# EAGLE design ESPIOX32 V0.2 (EAGLE 7.6.0)
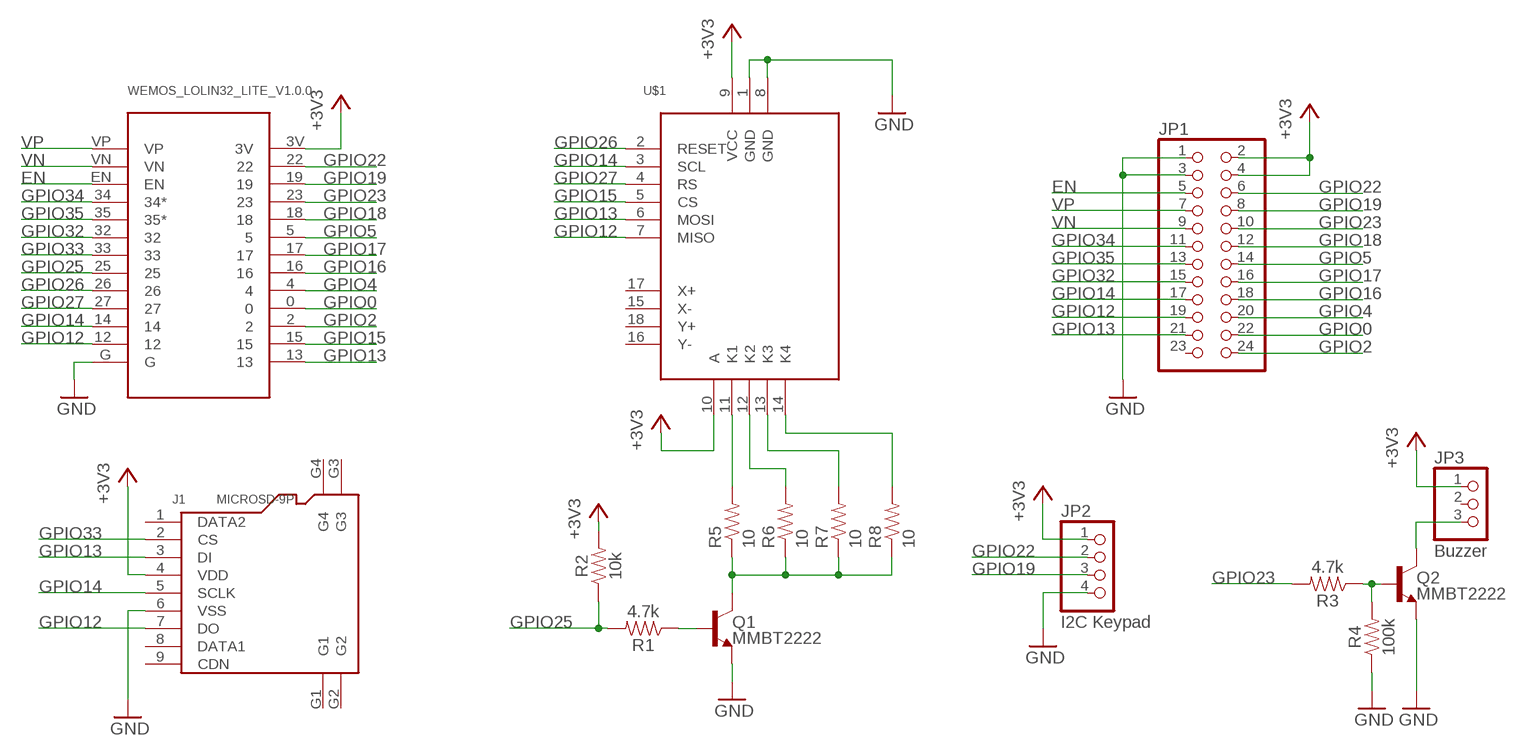
[diagram p0: schematic, sheet 1]

## Parts
J1  MICROSD-9P  MICRO-SD-CARD-HOLDER-9P  [MICRO-SD9+4P-SMD-16.1X14.5X1.85MM]
JP1  PINHD-2X12_2.54-SMD  [2X12SMD]
JP2  I2C Keypad  PINHD-1X04_2.54-SMD-90°  [1X04SMD/90]
JP3  Buzzer  PINHD-1X03_2.54-SMD-90°  [1X03SMD/90]
Q1  MMBT2222  TRANS_NPN-MMBT2222AL  [SOT23-3]
Q2  MMBT2222  TRANS_NPN-MMBT2222AL  [SOT23-3]
R1  4.7k  4.7KOHM-0603-1/10W-1%  [0603]
R2  10k  10KOHM-0603-1/10W-1%  [0603]
R3  4.7k  4.7KOHM-0603-1/10W-1%  [0603]
R4  100k  100KOHM-0603-1/10W-1%  [0603]
R5  10  10OHM-1/10W-5%0603SMD  [0603-RES]
R6  10  10OHM-1/10W-5%0603SMD  [0603-RES]
R7  10  10OHM-1/10W-5%0603SMD  [0603-RES]
R8  10  10OHM-1/10W-5%0603SMD  [0603-RES]
U$1  18P_3.2IN_TFT_LCD  [18PIN_TFTLCD]
WEMOS_LOLIN32_LITE_V1.0.0  WEMOS_LOLIN32_LITE_V1.0.0  [WEMOS_LOLIN32_LITE_V1.0.0]

## Nets
+3V3: J1.4(VDD) JP1.2 JP1.4 JP2.1 JP3.1 R2.2 U$1.9(VCC) U$1.10(A) WEMOS_LOLIN32_LITE_V1.0.0.3V
EN: JP1.5 WEMOS_LOLIN32_LITE_V1.0.0.EN
GND: J1.6(VSS) JP1.1 JP1.3 JP2.4 Q1.2(E) Q2.2(E) R4.1 U$1.1(GND) U$1.8(GND) WEMOS_LOLIN32_LITE_V1.0.0.G
GPIO0: JP1.22 WEMOS_LOLIN32_LITE_V1.0.0.0
GPIO2: JP1.24 WEMOS_LOLIN32_LITE_V1.0.0.2
GPIO4: JP1.20 WEMOS_LOLIN32_LITE_V1.0.0.4
GPIO5: JP1.14 WEMOS_LOLIN32_LITE_V1.0.0.5
GPIO12: J1.7(DO) JP1.19 U$1.7(MISO) WEMOS_LOLIN32_LITE_V1.0.0.12
GPIO13: J1.3(DI) JP1.21 U$1.6(MOSI) WEMOS_LOLIN32_LITE_V1.0.0.13
GPIO14: J1.5(SCLK) JP1.17 U$1.3(SCL) WEMOS_LOLIN32_LITE_V1.0.0.14
GPIO15: U$1.5(CS) WEMOS_LOLIN32_LITE_V1.0.0.15
GPIO16: JP1.18 WEMOS_LOLIN32_LITE_V1.0.0.16
GPIO17: JP1.16 WEMOS_LOLIN32_LITE_V1.0.0.17
GPIO18: JP1.12 WEMOS_LOLIN32_LITE_V1.0.0.18
GPIO19: JP1.8 JP2.3 WEMOS_LOLIN32_LITE_V1.0.0.19
GPIO22: JP1.6 JP2.2 WEMOS_LOLIN32_LITE_V1.0.0.22
GPIO23: JP1.10 R3.2 WEMOS_LOLIN32_LITE_V1.0.0.23
GPIO25: R1.2 R2.1 WEMOS_LOLIN32_LITE_V1.0.0.25
GPIO26: U$1.2(RESET) WEMOS_LOLIN32_LITE_V1.0.0.26
GPIO27: U$1.4(RS) WEMOS_LOLIN32_LITE_V1.0.0.27
GPIO32: JP1.15 WEMOS_LOLIN32_LITE_V1.0.0.32
GPIO33: J1.2(CS) WEMOS_LOLIN32_LITE_V1.0.0.33
GPIO34: JP1.11 WEMOS_LOLIN32_LITE_V1.0.0.34(34*)
GPIO35: JP1.13 WEMOS_LOLIN32_LITE_V1.0.0.35(35*)
N$1: Q1.3(C) R5.1 R6.1 R7.1 R8.1
N$2: Q1.1(B) R1.1
N$3: Q2.1(B) R3.1 R4.2
N$4: JP3.3 Q2.3(C)
N$6: R5.2 U$1.11(K1)
N$7: R6.2 U$1.12(K2)
N$8: R7.2 U$1.13(K3)
N$9: R8.2 U$1.14(K4)
VN: JP1.9 WEMOS_LOLIN32_LITE_V1.0.0.VN
VP: JP1.7 WEMOS_LOLIN32_LITE_V1.0.0.VP
Unconnected: J1.1(DATA2) J1.8(DATA1) J1.9(CDN) J1.G1 J1.G2 J1.G3 J1.G4 JP1.23 JP3.2 U$1.15(X-) U$1.16(Y-) U$1.17(X+) U$1.18(Y+)

## Library data of the parts
J1 = Seeed-OPL-Connector:MICRO-SD-CARD-HOLDER-9P: 320090008
JP1 = pinhead-2:PINHD-2X12: PIN HEADER
JP2 = pinhead-2:PINHD-1X04: PIN HEADER
JP3 = pinhead-2:PINHD-1X03: PIN HEADER
Q1 Q2 = SparkFun-DiscreteSemi:TRANS_NPN: NPN transistor Current controlled devices typically used to amplify current or used as a switch. BC547 - COM-08928 <http://www.sparkfun.com/products/8928> (TO-92 45V 100mA) (1.Collector 2.Base 3.Emitter) 2N3904 - COM-00521 <http://www.sparkfun.com/products/521> (TO-92 40V 200mA) (1.Emitter 2.Base 3.Collector) P2N2222A - COM-12852 <http://www.sparkfun.com/products/12852> (TO-92 40V 600mA) (1.Collector 2.Base 3.Emitter); PROD_ID: TRANS-08049; VALUE: 600mA/40V
R1 R3 = SparkFun-Resistors:4.7KOHM: 4.7kΩ resistor A resistor is a passive two-terminal electrical component that implements electrical resistance as a circuit element. Resistors act to reduce current flow, and, at the same time, act to lower voltage levels within circuits. - Wikipedia; PROD_ID: RES-07857
R2 = SparkFun-Resistors:10KOHM: 10kΩ resistor A resistor is a passive two-terminal electrical component that implements electrical resistance as a circuit element. Resistors act to reduce current flow, and, at the same time, act to lower voltage levels within circuits. - Wikipedia; PROD_ID: RES-00824
R4 = SparkFun-Resistors:100KOHM: 100kΩ resistor A resistor is a passive two-terminal electrical component that implements electrical resistance as a circuit element. Resistors act to reduce current flow, and, at the same time, act to lower voltage levels within circuits. - Wikipedia; PROD_ID: RES-07828
R5-R8 = SparkFun-Resistors:10OHM-1/10W-5%0603: RES-09834; PROD_ID: RES-09834
U$1 = 18P_3.2in_TFT_LCD:18P_3.2IN_TFT_LCD
WEMOS_LOLIN32_LITE_V1.0.0 = WEMOS_LOLIN32_Lite_V1.0.0:WEMOS_LOLIN32_LITE_V1.0.0

## Board
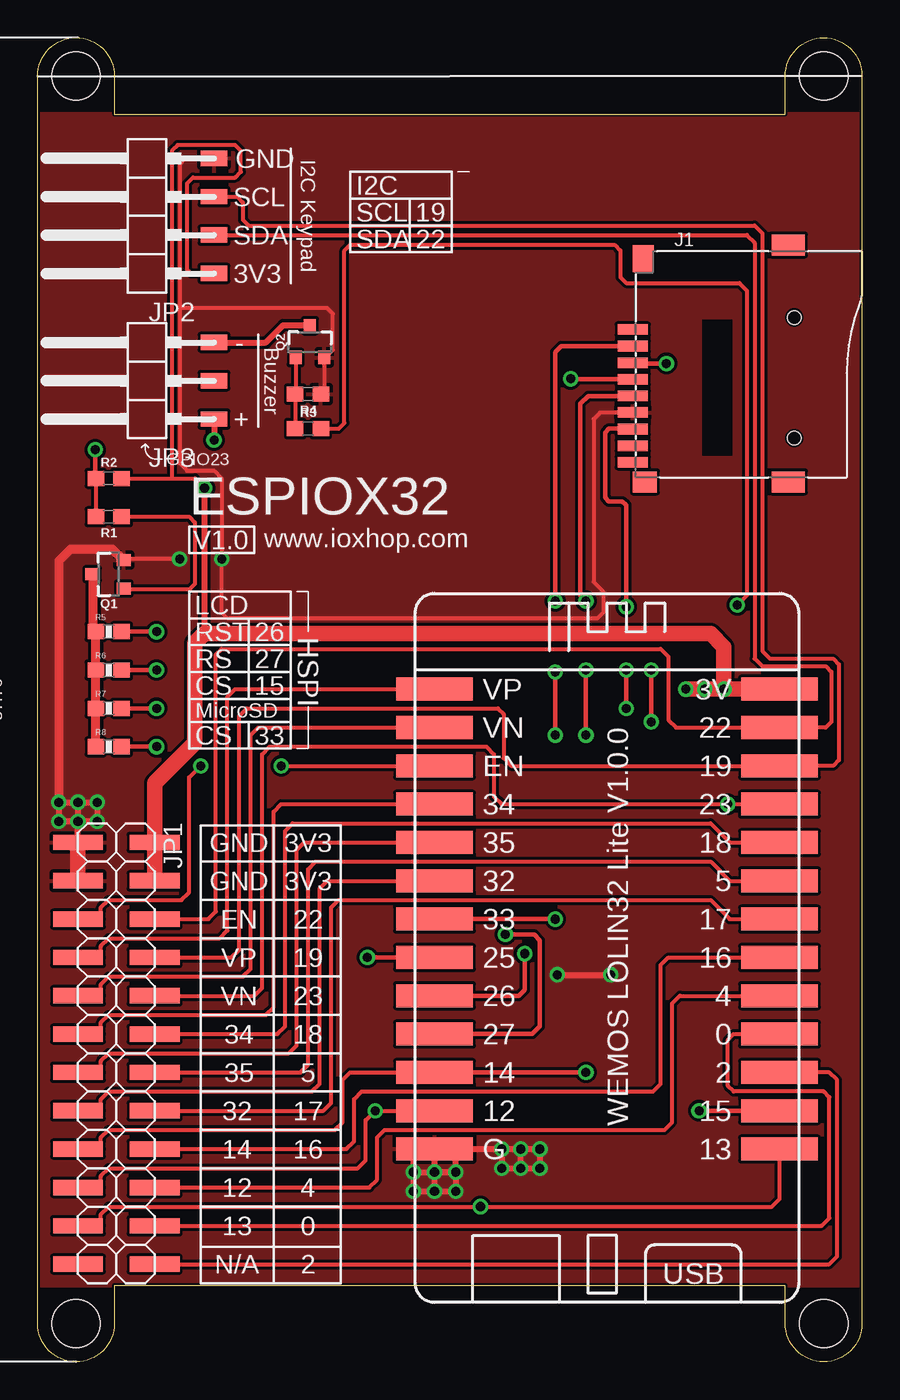
[diagram p1: board, top side]
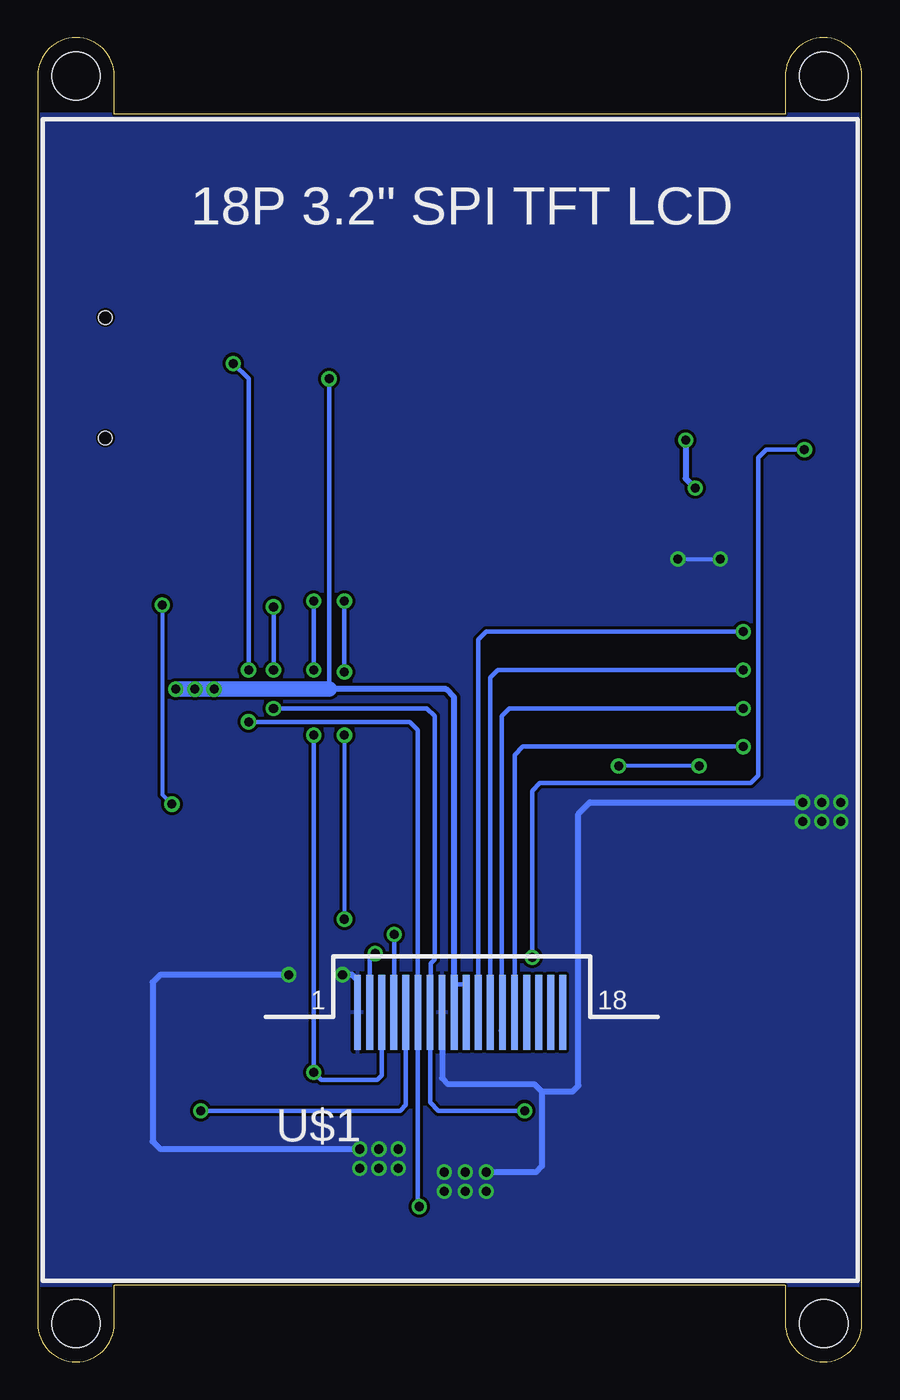
[diagram p2: board, bottom side, seen from below]

Size 54.61 x 87.76 mm. Coordinates in mm from the lower left corner, seen from the top.
Outline: 0,2.54 0,85.22 arc-180 5.08,85.22 5.08,82.68 49.53,82.68 49.53,85.22 arc-180 54.61,85.22 54.61,2.54 arc-180 49.53,2.54 49.53,5.08 5.08,5.08 5.08,2.54 arc-180 0,2.54
Copper layers (1*16): Top 0.035mm / dielectric 1.5mm / Bottom 0.035mm
Design rules "default *": minimum track width 6mil, minimum drill 20mil, track to track 8mil, track to pad 8mil, pad to pad 8mil, via to via 8mil, smd to smd 8mil, copper to edge 6mil, drill to drill 8mil, minimum pad ring 10mil, minimum via ring 8mil, stop-mask expansion 0mil, vias tented up to drill 32mil, thermal gap 10mil
Holes 3.2 mm at 2.54,85.22 52.07,85.22 52.07,2.54 2.54,2.54

### Footprints (pad centres in the part's own frame; a part is rotated, then mirrored left to right if it is on the bottom)
MICRO-SD9+4P-SMD-16.1X14.5X1.85MM = smd 2 x 0.7: 1 -0.2,2.25; 2 -0.2,1.15; 3 -0.2,0.05; 4 -0.2,-1.05; 5 -0.2,-2.15; 6 -0.2,-3.25; 7 -0.2,-4.35; 8 -0.2,-5.45; 9 -0.2,-6.55 | smd 1.6 x 1.4: G1 0.6,-7.85 | smd 2.2 x 1.4: G2 10.1,-7.85; G3 10.1,7.85 | smd 1.4 x 1.8: G4 0.5,6.95 | hole 0.9: 10.5,-4.95; 10.5,3.05
2X12SMD = smd 1.016 x 3.302: 1 -1.27,-3.81; 2 -1.27,1.27; 3 1.27,-3.81; 4 1.27,1.27; 5 3.81,-3.81; 6 3.81,1.27; 7 6.35,-3.81; 8 6.35,1.27; 9 8.89,-3.81; 10 8.89,1.27; 11 11.43,-3.81; 12 11.43,1.27; 13 13.97,-3.81; 14 13.97,1.27; 15 16.51,-3.81; 16 16.51,1.27; 17 19.05,-3.81; 18 19.05,1.27; 19 21.59,-3.81; 20 21.59,1.27; 21 24.13,-3.81; 22 24.13,1.27; 23 26.67,-3.81; 24 26.67,1.27
1X04SMD/90 = smd 1.016 x 1.778: 1 -1.27,-5.08; 2 1.27,-5.08; 3 3.81,-5.08; 4 6.35,-5.08
1X03SMD/90 = smd 1.016 x 1.778: 1 -1.27,-5.08; 2 1.27,-5.08; 3 3.81,-5.08
SOT23-3 = smd 0.8 x 0.9: 1 -0.95,-1; 2 0.95,-1; 3 0,1.1
0603 = smd 1.1 x 1: 1 -0.85,0; 2 0.85,0
0603-RES = smd 1.1 x 1: 1 -0.85,0; 2 0.85,0
18PIN_TFTLCD = smd 0.45 x 5: 1 -4.59,-21.42; 2 -3.79,-21.42; 3 -2.99,-21.42; 4 -2.19,-21.42; 5 -1.39,-21.42; 6 -0.59,-21.42; 7 0.21,-21.42; 8 1.01,-21.42; 9 1.81,-21.42; 10 2.61,-21.42; 11 3.41,-21.42; 12 4.21,-21.42; 13 5.01,-21.42; 14 5.81,-21.42; 15 6.61,-21.42; 16 7.41,-21.42; 17 8.21,-21.42; 18 9.01,-21.42
WEMOS_LOLIN32_LITE_V1.0.0 = smd 1.524 x 5.08: 0 6.35,10.16; 2 8.89,10.16; 3V -16.51,10.16; 4 3.81,10.16; 5 -3.81,10.16; 12 11.43,-12.7; 13 13.97,10.16; 14 8.89,-12.7; 15 11.43,10.16; 16 1.27,10.16; 17 -1.27,10.16; 18 -6.35,10.16; 19 -11.43,10.16; 22 -13.97,10.16; 23 -8.89,10.16; 25 1.27,-12.7; 26 3.81,-12.7; 27 6.35,-12.7; 32 -3.81,-12.7; 33 -1.27,-12.7; 34 -8.89,-12.7; 35 -6.35,-12.7; EN -11.43,-12.7; G 13.97,-12.7; VN -13.97,-12.7; VP -16.51,-12.7

### Placement (x,y rotation side)
J1  39.62,66.17 0 top
JP1  6.48,33.15 270 top
JP2  6.6,73.41 90 top
JP3  6.6,63.75 90 top
Q1  4.7,52.2 90 top
Q2  18.03,67.56 0 top
R1  4.7,56.01 180 top
R2  4.7,58.55 0 top
R3  17.91,61.85 0 top
R4  17.91,64.14 180 top
R5  4.7,48.39 0 top
R6  4.7,45.85 0 top
R7  4.7,43.31 0 top
R8  4.7,40.77 0 top
U$1  28.83,44.58 0 bottom
WEMOS_LOLIN32_LITE_V1.0.0  38.99,28.07 270 top

### Tracks (layer width: path | path; a pad name or v marks a point on that pad's centre or on a via)
+3V3  (via drill 0.6)
  Top 0.254: R2.2 8.89,58.55 | 8.89,58.55 10.41,58.55 v11.05,57.91 11.05,57.79 | JP2.1 10.16,72.14 9.91,72.39 9.91,78.11 10.29,78.49 13.08,78.49 13.46,78.87 13.46,80.26 13.08,80.65 9.27,80.65 8.89,80.26 8.89,58.55
  Top 0.305: J1.4 35.21,65.12 v35.31,65.15
  Top 0.406: 11.05,57.79 11.05,48.26 | JP3.1 v11.68,61.09
  Top 1.016: v45.47,44.58 WEMOS_LOLIN32_LITE_V1.0.0.3V | JP1.4 JP1.2 7.75,38.35 10.41,41.02 10.41,47.63 11.05,48.26 44.58,48.26 45.47,47.37 v45.47,44.58 | v42.93,44.58 v45.47,44.58
  Bottom 0.305: U$1.10 26.22,24.82 26.42,25.02 27.05,25.02 27.05,21.92 U$1.9 | v35.31,65.15 35.31,44.58
  Bottom 0.406: U$1.9 27.02,44.04 27.56,44.58 35.31,44.58 | v11.68,61.09 11.68,58.55 v11.05,57.91
  Bottom 1.016: 35.31,44.58 v42.93,44.58 v44.2,44.58 v45.47,44.58
EN  (via drill 0.6)
  Top 0.254: JP1.5 4.19,29.34 4.19,30.1 4.7,30.61 9.52,30.61 10.03,31.12 10.03,38.74 v10.8,39.5 | v16.13,39.5 WEMOS_LOLIN32_LITE_V1.0.0.EN
  Bottom 0.254: v10.8,39.5 v16.13,39.5
GND  (via drill 0.6)
  Top 0.254: J1.6 37.26,62.92 36.83,62.48 36.83,51.69 37.46,51.05 37.46,49.66 37.08,49.28 12.57,49.28 12.19,49.66 v12.19,53.21 12.19,58.55 11.68,59.06 9.91,59.06 9.4,59.56 9.4,69.85 | v9.4,53.21 5.77,53.21 5.72,53.16 Q1.2 | JP2.4 9.78,79.76 9.4,79.38 9.4,69.85 | 18.98,66.48 18.98,64.11 R4.1 | Q2.2 18.98,66.48 | 18.98,66.48 19.56,67.06 19.56,69.47 19.18,69.85 9.4,69.85
  Top 0.406: v24.89,12.57 v26.29,12.57 | v26.29,12.57 v27.69,12.57 | v27.69,12.57 27.69,14.1 | 27.69,14.1 26.54,14.1 | 26.54,14.1 WEMOS_LOLIN32_LITE_V1.0.0.G | v26.29,11.3 26.29,12.45 | 26.29,12.45 v26.29,12.57 | v27.69,12.57 26.42,12.57 26.29,12.45 | v26.29,12.57 26.29,14.22 26.54,14.1 | 26.54,14.1 25.02,14.35 24.89,14.22 v24.89,12.57 | v24.89,12.57 v24.89,11.3 v26.29,11.3 | v26.29,11.3 v27.69,11.3 v27.69,12.57 | 27.69,14.1 v30.73,14.1 | v30.73,14.1 v32,14.1 | v32,14.1 v33.27,14.1 v33.27,12.83 v30.73,12.83 v30.73,14.1 | v32,12.83 v32,14.1 | v34.42,25.65 v37.97,25.65 | JP1.1 v2.67,35.81 | v2.67,35.81 v1.4,35.81 v1.4,37.08 v2.67,37.08 | v2.67,37.08 v3.94,37.08 v3.94,35.81 v2.67,35.81 | v2.67,37.08 v2.67,35.81
  Top 0.61: 5.72,53.16 5.64,53.16 4.95,53.85 2.16,53.85 1.4,53.09 v1.4,37.08
  Top 1.016: JP1.1 JP1.3
  Bottom 0.254: v12.19,53.21 v9.4,53.21
  Bottom 0.406: U$1.8 27.82,18.8 27.43,18.42 21.72,18.42 21.21,17.91 | 21.21,17.91 21.21,12.95 21.59,12.57 v24.89,12.57 | U$1.1 33.42,25.29 33.78,25.65 v34.42,25.65 | v37.97,25.65 46.48,25.65 46.99,25.15 46.99,14.61 46.48,14.1 v33.27,14.1 | 21.21,17.91 19.18,17.91 18.8,18.29 18.8,36.32 18.03,37.08 v3.94,37.08
  pour Top: -0.13,82.68 -0.13,5.08 54.74,5.08 54.74,82.68
  pour Bottom: -0.38,82.68 -0.38,5.08 54.99,5.08 54.99,82.68
GPIO0
  Top 0.254: WEMOS_LOLIN32_LITE_V1.0.0.0 46.1,21.72 45.72,21.34 45.72,18.29 46.1,17.91 52.07,17.91 52.45,17.53 52.45,9.53 51.94,9.02 JP1.22
GPIO2
  Top 0.254: JP1.24 52.45,6.48 52.96,6.99 52.96,18.67 52.45,19.18 WEMOS_LOLIN32_LITE_V1.0.0.2
GPIO4
  Top 0.254: JP1.20 21.97,11.56 22.48,12.07 22.48,14.86 22.99,15.37 41.53,15.37 42.04,15.88 42.04,23.75 42.54,24.26 WEMOS_LOLIN32_LITE_V1.0.0.4
GPIO5
  Top 0.254: JP1.14 17.4,19.18 17.91,19.69 17.91,32.64 18.41,33.15 44.58,33.15 45.85,31.88 WEMOS_LOLIN32_LITE_V1.0.0.5
GPIO12  (via drill 0.6)
  Top 0.254: JP1.19 4.19,11.56 4.19,12.32 4.7,12.83 21.21,12.83 21.72,13.34 21.72,16 v22.35,16.64 WEMOS_LOLIN32_LITE_V1.0.0.12
  Top 0.305: v38.99,45.85 v38.99,43.31 | v38.99,50.04 38.99,56.77 38.74,57.02 37.85,57.02 37.59,57.28 37.59,61.6 37.85,61.85 39.02,61.85
  Top 0.406: 39.02,61.85 J1.7
  Bottom 0.305: v22.35,16.64 28.07,16.64 28.62,17.19 U$1.7 28.58,21.93 28.58,26.42 28.32,26.67 28.32,42.8 28.83,43.31 v38.99,43.31 | v38.99,50.04 v38.99,45.85
GPIO13  (via drill 0.6)
  Top 0.254: JP1.21 4.19,9.02 4.19,9.78 4.7,10.29 v29.34,10.29 | 29.46,10.29 48.64,10.29 49.15,10.8 WEMOS_LOLIN32_LITE_V1.0.0.13
  Top 0.305: v29.34,10.29 29.46,10.29 | v40.64,42.42 v40.64,45.85 | v41.66,66.17 39.04,66.17 J1.3
  Bottom 0.305: v29.34,10.29 29.42,10.37 U$1.6 29.42,41.87 29.97,42.42 v40.64,42.42 | v40.64,45.85 40.64,65.15 v41.66,66.17
GPIO14  (via drill 0.6)
  Top 0.254: JP1.17 4.19,14.1 4.19,14.86 4.7,15.37 19.69,15.37 20.19,15.88 20.19,18.67 20.7,19.18 WEMOS_LOLIN32_LITE_V1.0.0.14
  Top 0.305: v36.32,19.18 WEMOS_LOLIN32_LITE_V1.0.0.14 | J1.5 36.46,64.02 35.94,63.5 35.94,50.8 v36.32,50.42 | v36.32,45.85 v36.32,41.53
  Bottom 0.305: U$1.3 31.82,18.98 32.13,18.67 35.81,18.67 v36.32,19.18 v36.32,41.53 | v36.32,50.42 v36.32,45.85
GPIO15  (via drill 0.6)
  Top 0.305: v43.82,16.64 WEMOS_LOLIN32_LITE_V1.0.0.15
  Bottom 0.305: U$1.5 30.22,17.03 30.61,16.64 v43.82,16.64
GPIO16
  Top 0.254: JP1.18 20.45,14.1 20.95,14.61 20.95,17.4 21.46,17.91 40.77,17.91 41.27,18.42 41.27,26.29 41.78,26.8 WEMOS_LOLIN32_LITE_V1.0.0.16
GPIO17
  Top 0.254: JP1.16 18.92,16.64 19.43,17.15 19.43,30.1 19.94,30.61 44.58,30.61 45.85,29.34 WEMOS_LOLIN32_LITE_V1.0.0.17
GPIO18
  Top 0.254: JP1.12 15.88,21.72 16.38,22.23 16.38,35.18 16.89,35.69 44.58,35.69 45.85,34.42 WEMOS_LOLIN32_LITE_V1.0.0.18
GPIO19
  Top 0.254: JP2.3 13.21,77.22 13.59,76.84 13.59,75.69 13.97,75.31 47.5,75.31 48.01,74.8 48.01,47.12 48.51,46.61 52.71,46.61 53.09,46.23 53.09,39.88 52.71,39.5 WEMOS_LOLIN32_LITE_V1.0.0.19 31.37,39.5 30.86,40.01 30.86,42.93 30.48,43.31 13.84,43.31 13.34,42.8 13.34,27.31 12.83,26.8 JP1.8
GPIO22
  Top 0.254: JP1.6 11.3,29.34 11.81,29.85 11.81,46.86 12.19,47.24 41.27,47.24 41.78,46.74 41.78,42.55 42.29,42.04 WEMOS_LOLIN32_LITE_V1.0.0.22 52.2,42.04 52.58,42.42 52.58,45.72 52.2,46.1 48.01,46.1 47.5,46.61 47.5,74.17 46.99,74.68 JP2.2
GPIO23  (via drill 0.6)
  Top 0.254: JP1.10 14.35,24.26 14.86,24.77 14.86,40.26 15.37,40.77 29.72,40.77 30.23,40.26 30.23,37.47 30.73,36.96 v45.72,36.96 WEMOS_LOLIN32_LITE_V1.0.0.23 | R3.2 19.94,61.85 20.32,62.23 20.32,73.66 20.7,74.04 38.23,74.04 38.61,73.66 38.61,71.88 38.99,71.5 46.48,71.5 46.99,70.99 46.99,50.8 v46.35,50.17
  Bottom 0.254: v46.35,50.17 46.35,37.59 v45.72,36.96
GPIO25  (via drill 0.6)
  Top 0.254: R2.1 R1.2
  Top 0.305: WEMOS_LOLIN32_LITE_V1.0.0.25 v21.84,26.8 | v3.81,60.45 3.81,58.59 R2.1
  Bottom 0.305: v21.84,26.8 21.84,37.85 21.34,38.35 7.37,38.35 6.86,38.86 6.86,59.94 6.35,60.45 v3.81,60.45
GPIO26  (via drill 0.6)
  Top 0.305: v32.26,27.05 32.26,24.64 31.88,24.26 WEMOS_LOLIN32_LITE_V1.0.0.26
  Bottom 0.305: U$1.2 32.62,26.69 v32.26,27.05
GPIO27  (via drill 0.6)
  Top 0.305: WEMOS_LOLIN32_LITE_V1.0.0.27 32.77,21.72 33.27,22.23 33.27,27.94 32.89,28.32 v30.99,28.32
  Bottom 0.305: v30.99,28.32 30.99,21.92 U$1.4
GPIO32
  Top 0.254: JP1.15 4.19,16.64 4.19,17.4 4.7,17.91 18.16,17.91 18.67,18.42 18.67,31.37 19.18,31.88 WEMOS_LOLIN32_LITE_V1.0.0.32
GPIO33  (via drill 0.6)
  Top 0.305: J1.2 34.68,67.32 34.29,66.93 v34.29,50.42 | v34.29,45.72 v34.29,41.53 | v34.29,29.34 WEMOS_LOLIN32_LITE_V1.0.0.33
  Bottom 0.254: v34.29,41.53 v34.29,29.34
  Bottom 0.305: v34.29,50.42 v34.29,45.72
GPIO34
  Top 0.254: JP1.11 4.19,21.72 4.19,22.48 4.7,22.99 15.11,22.99 15.62,23.5 15.62,36.45 16.13,36.96 WEMOS_LOLIN32_LITE_V1.0.0.34
GPIO35
  Top 0.254: JP1.13 4.19,19.18 4.19,19.94 4.7,20.45 16.64,20.45 17.15,20.96 17.15,33.91 17.65,34.42 WEMOS_LOLIN32_LITE_V1.0.0.35
N$1
  Top 0.61: R8.1 R7.1 R6.1 R5.1 3.68,48.39 3.68,52.11 Q1.3
N$2
  Top 0.254: R1.1 10.03,56.01 10.41,55.63 10.41,51.56 10.03,51.18 5.77,51.18 Q1.1
N$3
  Top 0.254: Q2.1 17.08,64.03 | R3.1 17.08,61.95 17.08,64.03 | 17.08,64.03 R4.2
N$4
  Top 0.254: 17.99,68.71 Q2.3
  Top 0.406: JP3.3 15.11,67.56 16.26,68.71 17.99,68.71
N$6  (via drill 0.6)
  Top 0.305: v7.87,48.39 R5.2
  Bottom 0.305: U$1.11 25.42,47.86 24.89,48.39 v7.87,48.39
N$7  (via drill 0.6)
  Top 0.305: v7.87,45.85 R6.2
  Bottom 0.305: U$1.12 24.64,22.12 24.64,45.34 24.13,45.85 v7.87,45.85
N$8  (via drill 0.6)
  Top 0.305: v7.87,43.31 R7.2
  Bottom 0.305: 23.88,21.96 23.88,42.8 23.37,43.31 v7.87,43.31
  Bottom 0.406: U$1.13 23.88,21.96
N$9  (via drill 0.6)
  Top 0.305: v7.87,40.77 R8.2
  Bottom 0.305: U$1.14 23.02,40.23 22.48,40.77 v7.87,40.77
VN
  Top 0.254: JP1.9 4.19,24.26 4.19,25.02 4.7,25.53 13.59,25.53 14.1,26.04 14.1,41.53 14.61,42.04 WEMOS_LOLIN32_LITE_V1.0.0.VN
VP
  Top 0.254: JP1.7 4.19,26.8 4.19,27.56 4.7,28.07 12.06,28.07 12.57,28.58 12.57,44.07 13.08,44.58 WEMOS_LOLIN32_LITE_V1.0.0.VP

### Text on the board
tPlace: GND | I2C | SCL | I2C Keypad | SCL | 19 | SDA | SDA | 22 | 3V3 | - | Buzzer | + | GPIO23 | ESPIOX32 | V1.0 | www.ioxhop.com | LCD | RST | 26 | RS | 27 | HSPI | CS | 15 | MicroSD | CS | 33 | GND | 3V3 | GND | 3V3 | EN | 22 | VP | 19 | VN | 23 | 34 | 18 | 35 | 5 | 32 | 17 | 14 | 16 | 12 | 4 | 13 | 0 | N/A | 2